# EAGLE design btnsm (EAGLE 8.2.2)
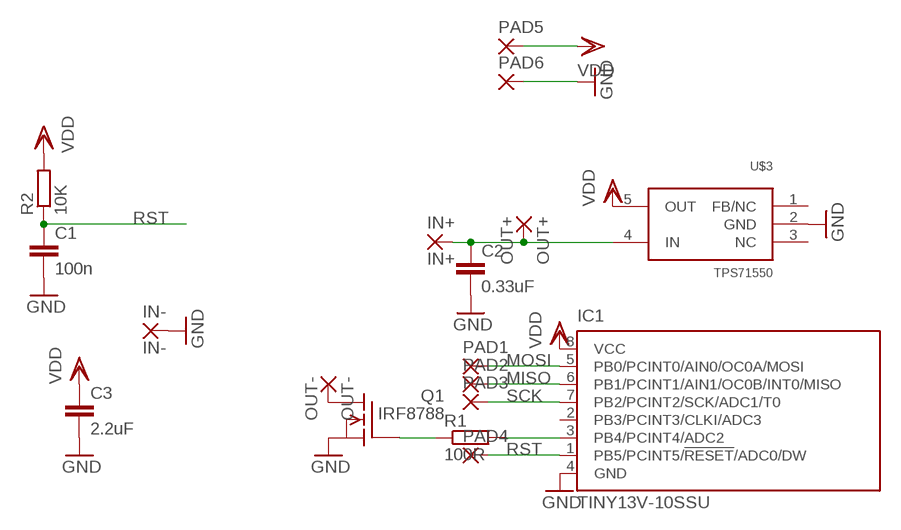
[diagram p0: schematic, sheet 1]

## Parts
C1  100n  C-EUC0603  [C0603]
C2  0.33uF  C-EUC0603  [C0603]
C3  2.2uF  C-EUC0603  [C0603]
IC1  TINY13V-10SSU  [8S1]
IN+  IN+  SMD5  [SMD2,54-5,08]
IN-  IN-  SMD5  [SMD2,54-5,08]
OUT+  OUT+  SMD5  [SMD2,54-5,08]
OUT-  OUT-  SMD5  [SMD2,54-5,08]
PAD1  1,6/0,9  [1,6/0,9]
PAD2  1,6/0,9  [1,6/0,9]
PAD3  1,6/0,9  [1,6/0,9]
PAD4  1,6/0,9  [1,6/0,9]
PAD5  1,6/0,9  [1,6/0,9]
PAD6  1,6/0,9  [1,6/0,9]
Q1  IRF8788  FDS5680  [SO-8]
R1  100R  R-EU_R0402  [R0402]
R2  10K  R-EU_R0402  [R0402]
U$3  TPS71550  TPS715  [SC70]

## Nets
GND: C1.2 C2.2 C3.2 IC1.4(GND) IN-.1(P) PAD6.1(P) Q1.1(S) Q1.2(S) Q1.3(S) U$3.2(GND)
MISO: IC1.6(PB1/PCINT1/AIN1/OC0B/INT0/MISO) PAD2.1(P)
MOSI: IC1.5(PB0/PCINT0/AIN0/OC0A/MOSI) PAD1.1(P)
N$1: IC1.3(PB4/PCINT4/ADC2) R1.2
N$2: Q1.4(G) R1.1
N$3: C2.1 IN+.1(P) OUT+.1(P) U$3.4(IN)
N$4: OUT-.1(P) Q1.5(D) Q1.6(D) Q1.7(D) Q1.8(D)
RST: C1.1 IC1.1(PB5/PCINT5/!RESET!/ADC0/DW) PAD4.1(P) R2.1
SCK: IC1.7(PB2/PCINT2/SCK/ADC1/T0) PAD3.1(P)
VDD: C3.1 IC1.8(VCC) PAD5.1(P) R2.2 U$3.5(OUT)
Unconnected: IC1.2(PB3/PCINT3/CLKI/ADC3) U$3.1(FB/NC) U$3.3(NC)

## Library data of the parts
C1-C3 = resistor:C-EU: CAPACITOR, European symbol
IC1 = atmel:TINY13: 8-bit AVR Microcontroller with 1K Bytes In-System Programmable Flash Source: http://www.atmel.com/dyn/resources/prod_documents/2535S.pdf; MPN: ATTINY13V-10SSU; OC_FARNELL: 1455135; OC_NEWARK: 58M3773
IN+ IN- OUT+ OUT- = wirepad:SMD5: SMD PAD
PAD1-PAD6 = wirepad:1,6/0,9: THROUGH-HOLE PAD
Q1 = transistor-fet:FDS5680: 60V N-Channel PowerTrench TM MOSFET FAIRCHILD FDS5680.pdf
R1 R2 = rcl:R-EU_: RESISTOR, European symbol
U$3 = TPS715:TPS715

## Board
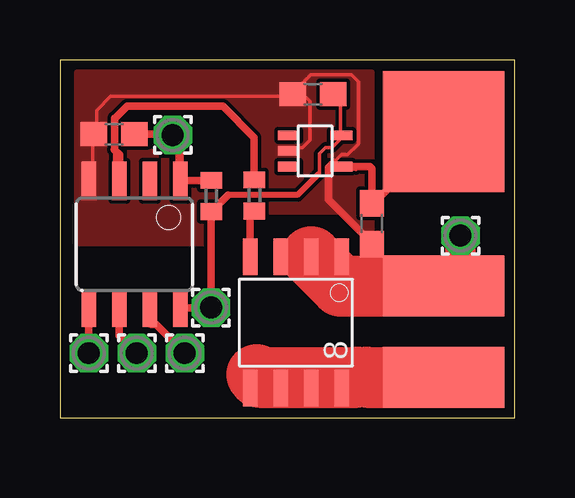
[diagram p1: board, top side]

Size 18.97 x 14.93 mm. Coordinates in mm from the lower left corner, seen from the top.
Outline: 0,0 18.97,0 18.97,14.93 0,14.93 0,0
Copper layers (1*16): Top 0.035mm / dielectric 1.5mm / Bottom 0.035mm
Design rules "SeeedStudio_2layer_DRU_no_angle_20140221": minimum track width 6mil, minimum drill 12mil, track to track 6mil, track to pad 6mil, pad to pad 6mil, via to via 6mil, smd to smd 0mil, copper to edge 10mil, drill to drill 10mil, minimum pad ring 10mil, minimum via ring 6mil, stop-mask expansion 2mil, vias tented up to drill 100mil, thermal gap 10mil

### Footprints (pad centres in the part's own frame; a part is rotated, then mirrored left to right if it is on the bottom)
C0603 = smd 1.1 x 1: 1 -0.85,0; 2 0.85,0
8S1 = smd 0.6 x 1.6: 1 -1.905,-2.654; 2 -0.645,-2.654; 3 0.625,-2.654; 4 1.895,-2.654; 5 1.905,2.654; 6 0.635,2.654; 7 -0.635,2.654; 8 -1.905,2.654
SMD2,54-5,08 = smd 2.54 x 5.08: 1 0,0
1,6/0,9 = drill 0.914 pad 1.6 octagon: 1 0,0
SO-8 = smd 1.524 x 0.61: 1 -2.743,1.905; 2 -2.743,0.635; 3 -2.743,-0.635; 4 -2.743,-1.905; 5 2.743,-1.905; 6 2.743,-0.635; 7 2.743,0.635; 8 2.743,1.905
R0402 = smd 0.7 x 0.9: 1 -0.65,0; 2 0.65,0
SC70 = smd 0.9 x 0.4: 1 -1.1,0.65; 2 -1.1,0; 3 -1.1,-0.65; 4 1.1,-0.65; 5 1.1,0.65

### Placement (x,y rotation side)
C1  2.26,11.83 180 top
C2  13,8.1 270 top
C3  10.55,13.5 180 top
IC1  3.11,7.24 180 top
IN+  16,13.2 90 top
IN-  16,5.5 270 top
OUT+  16,10.7 90 top
OUT-  16,1.7 90 top
PAD1  1.2,2.7 90 top
PAD2  3.2,2.7 90 top
PAD3  5.2,2.7 90 top
PAD4  4.7,11.8 90 top
PAD5  6.3,4.6 90 top
PAD6  16.7,7.6 0 top
Q1  9.84,3.98 270 top
R1  8.11,9.28 90 top
R2  6.31,9.26 270 top
U$3  10.64,11.13 0 top

### Tracks (layer width: path | path; a pad name or v marks a point on that pad's centre or on a via)
GND
  Top 0.152: U$3.2 10.06,11.28 10.12,11.28 10.42,11.58 10.42,13.21 10.12,13.51 C3.2 | IC1.4 1.22,9.91 1.37,10.06 1.37,11.73 C1.2 1.52,11.89 1.52,12.82 2.11,13.41 9.76,13.41 C3.2 | 12.95,7.16 C2.2 13.11,7.16 | 11.89,6.86 Q1.1 11.73,6.86 | 9.3,6.86 Q1.3 | 10.36,6.86 Q1.2 10.52,6.86 | 15.24,6.25 15.85,5.64 IN-.1 15.24,6.25 | 15.24,6.25 15.39,6.25 | 11.43,10.67 11.73,10.97 12,10.97 12.45,11.43 12.45,14.02 12.15,14.33 10.48,14.33 9.72,13.56 C3.2
  Top 0.305: C2.2 13,7.3 11.2,9.1 11.2,10.05 11.2,10.44 11.43,10.67
  Top 0.406: C2.2 13,5.52 12.98,5.5 | Q1.1 11.74,5.55 11.7,5.5 | Q1.3 10.23,6.72 10.36,6.86
  Top 1.27: PAD6.1 16.7,6.2 IN-.1
  Top 2.54: IN-.1 12.98,5.5 11.7,5.5 Q1.2
  pour Top (no thermals): 13,7.4 13,14.4 0.7,14.4 0.7,7.3 8.1,7.3 8.1,8.2 8.5,8.6 11.8,8.6
MISO
  Top 0.305: IC1.6 2.48,3.42 PAD2.1
MOSI
  Top 0.305: IC1.5 PAD1.1
N$1
  Top 0.152: 2.29,11.3 2.29,10.06 2.44,9.91 IC1.3 | R1.2 8.08,10.06
  Top 0.305: R1.2 8.1,11.7 6.8,13 2.8,13 2.44,12.63 2.43,12.63 2.3,12.5 2.29,12.5 2.29,11.3 2.29,11.22 2.27,11.19 2.48,10.97 IC1.3
N$2
  Top 0.152: R1.1 8.08,8.53 | 8.08,6.86 Q1.4
  Top 0.305: Q1.4 7.93,8.46 R1.1
N$3
  Top 0.152: 12.34,10.36 U$3.4 | 12.95,8.99 C2.1 13.11,8.99 | 15.85,10.67 OUT+.1 16,10.82 16,13.11 IN+.1
  Top 0.305: OUT+.1 14.81,10.7 13.11,8.99 | U$3.4 12.92,10.48 13,10.4 C2.1
N$4
  Top 0.305: 12.4,1.7 12.79,1.7 | Q1.6 8.27,1.24
  Top 0.406: 8.27,1.24 Q1.5 | Q1.6 9.38,1.24 Q1.7 | 11.31,1.24 Q1.8
  Top 0.813: Q1.5 7.93,1.33 8.3,1.7 8.91,1.7 9.38,1.24 | Q1.7 11.31,1.24
  Top 2.54: 12.79,1.7 OUT-.1 | 12.4,1.7 8.3,1.7 8.2,1.8
RST
  Top 0.152: C1.1 3.2,11.89 4.57,11.89 PAD4.1 4.72,11.73 4.88,11.58 4.88,9.91 IC1.1
  Top 0.305: C1.1 4.62,11.83 4.83,11.63 | 4.83,11.63 4.88,11.58 | 4.83,11.63 5.01,11.44 IC1.1 6.29,9.89 R2.1
SCK
  Top 0.305: PAD3.1 4,3.9 3.8,3.9 3.7,4 3.7,4.54 IC1.7
VDD
  Top 0.152: C3.1 11.69,13.41 11.69,11.89 U$3.5 11.79,11.73 11.34,11.28 11.08,11.28 10.82,11.02 10.82,10.21 10.77,10.16 | 6.4,8.53 R2.2
  Top 0.254: 10.77,10.16 9.91,9.3 7.01,9.3
  Top 0.305: IC1.8 6.29,4.59 PAD5.1 R2.2 6.32,8.61 7.01,9.3